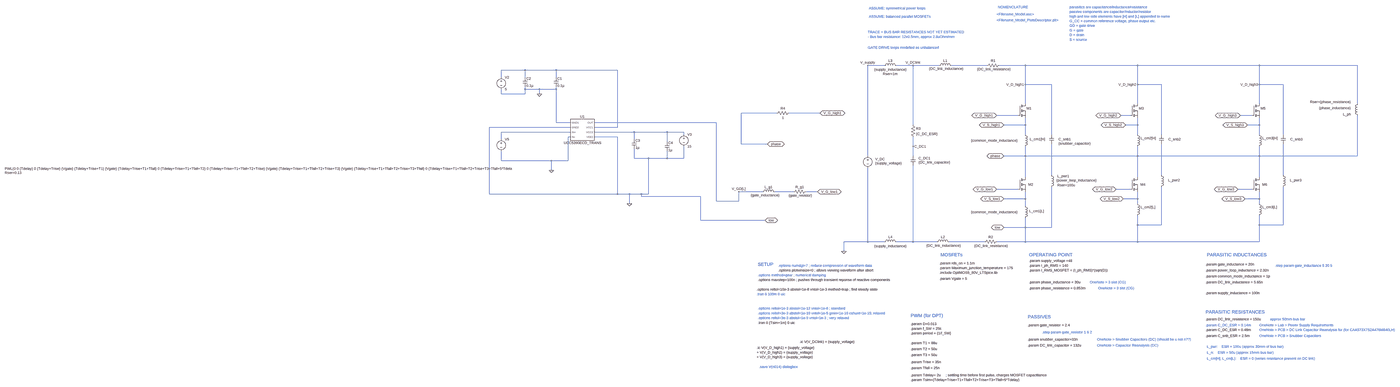
[diagram p0: schematic gate_driver_dpt.asc, whole sheet]
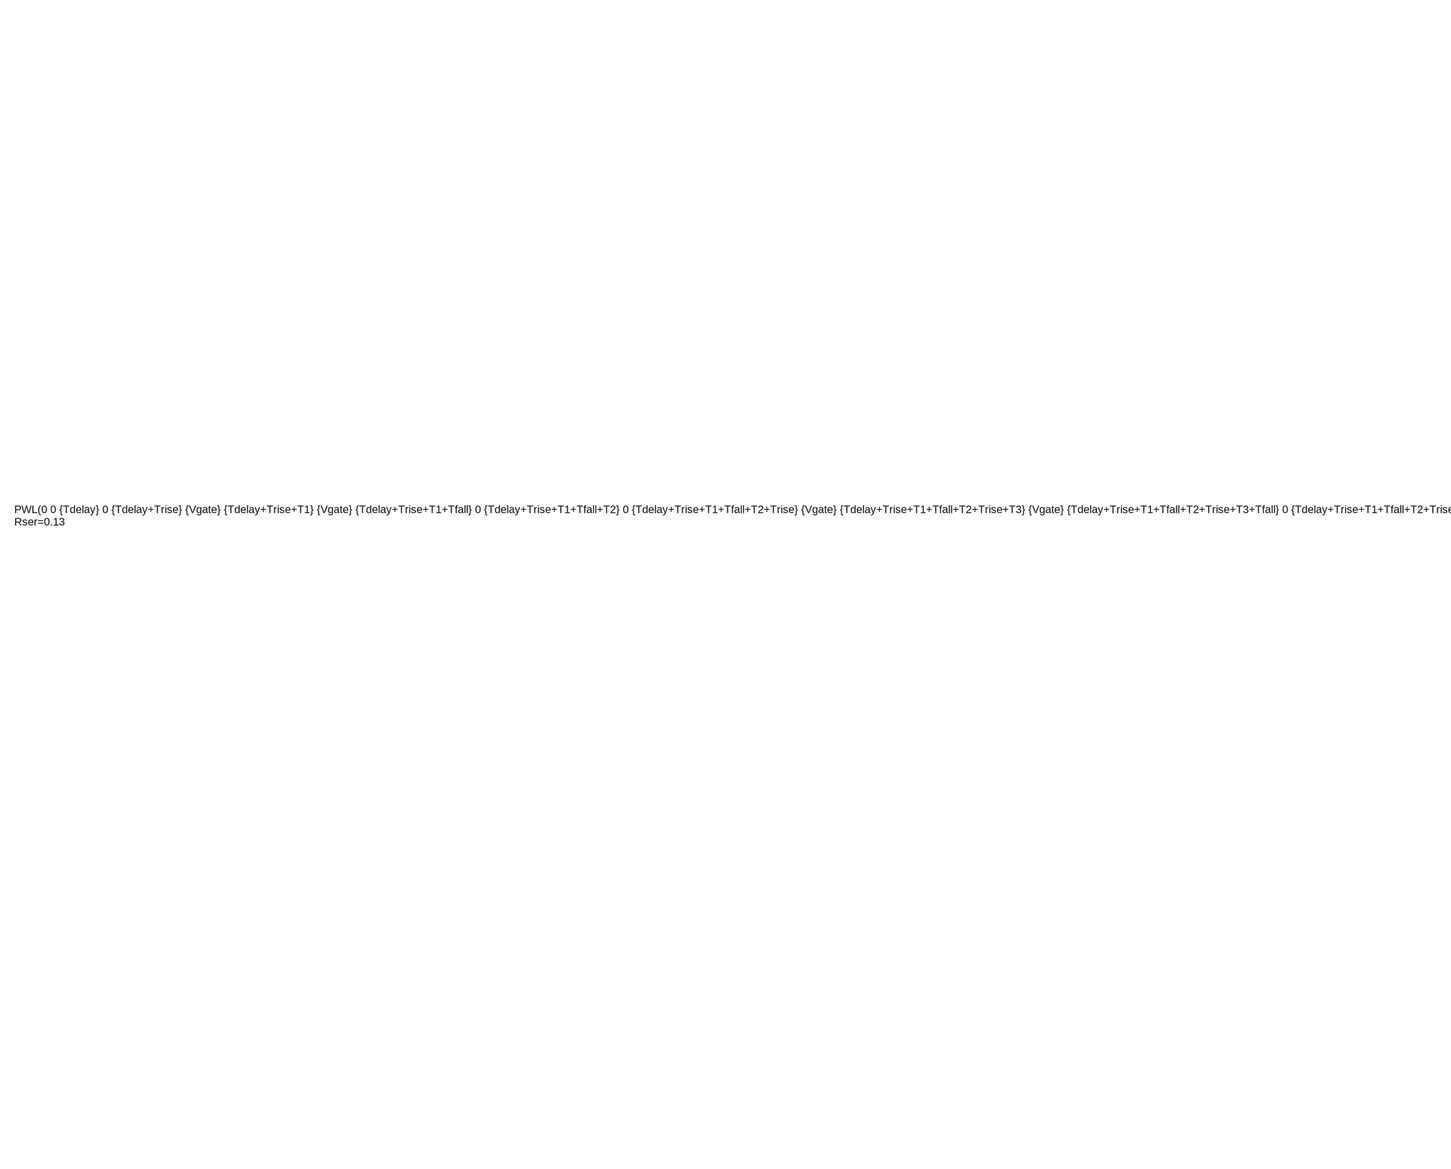
[diagram p1: schematic gate_driver_dpt.asc, part, row 1 of 1, column 1 of 3]
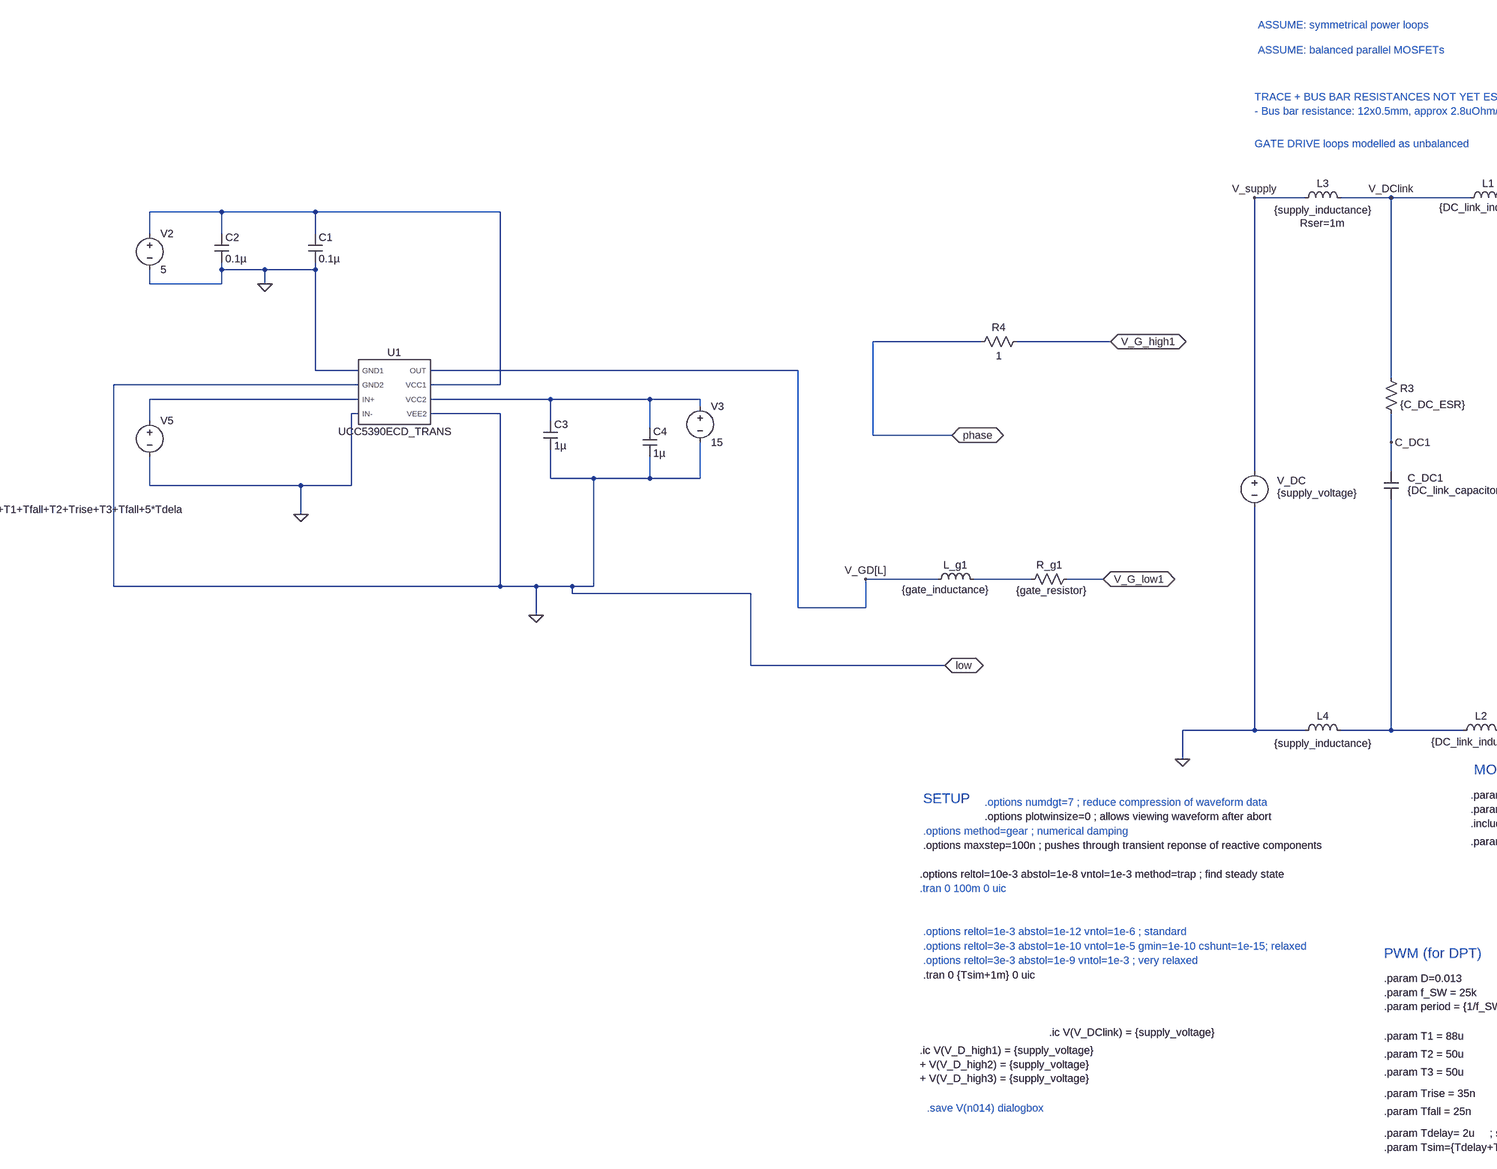
[diagram p2: schematic gate_driver_dpt.asc, part, row 1 of 1, column 2 of 3]
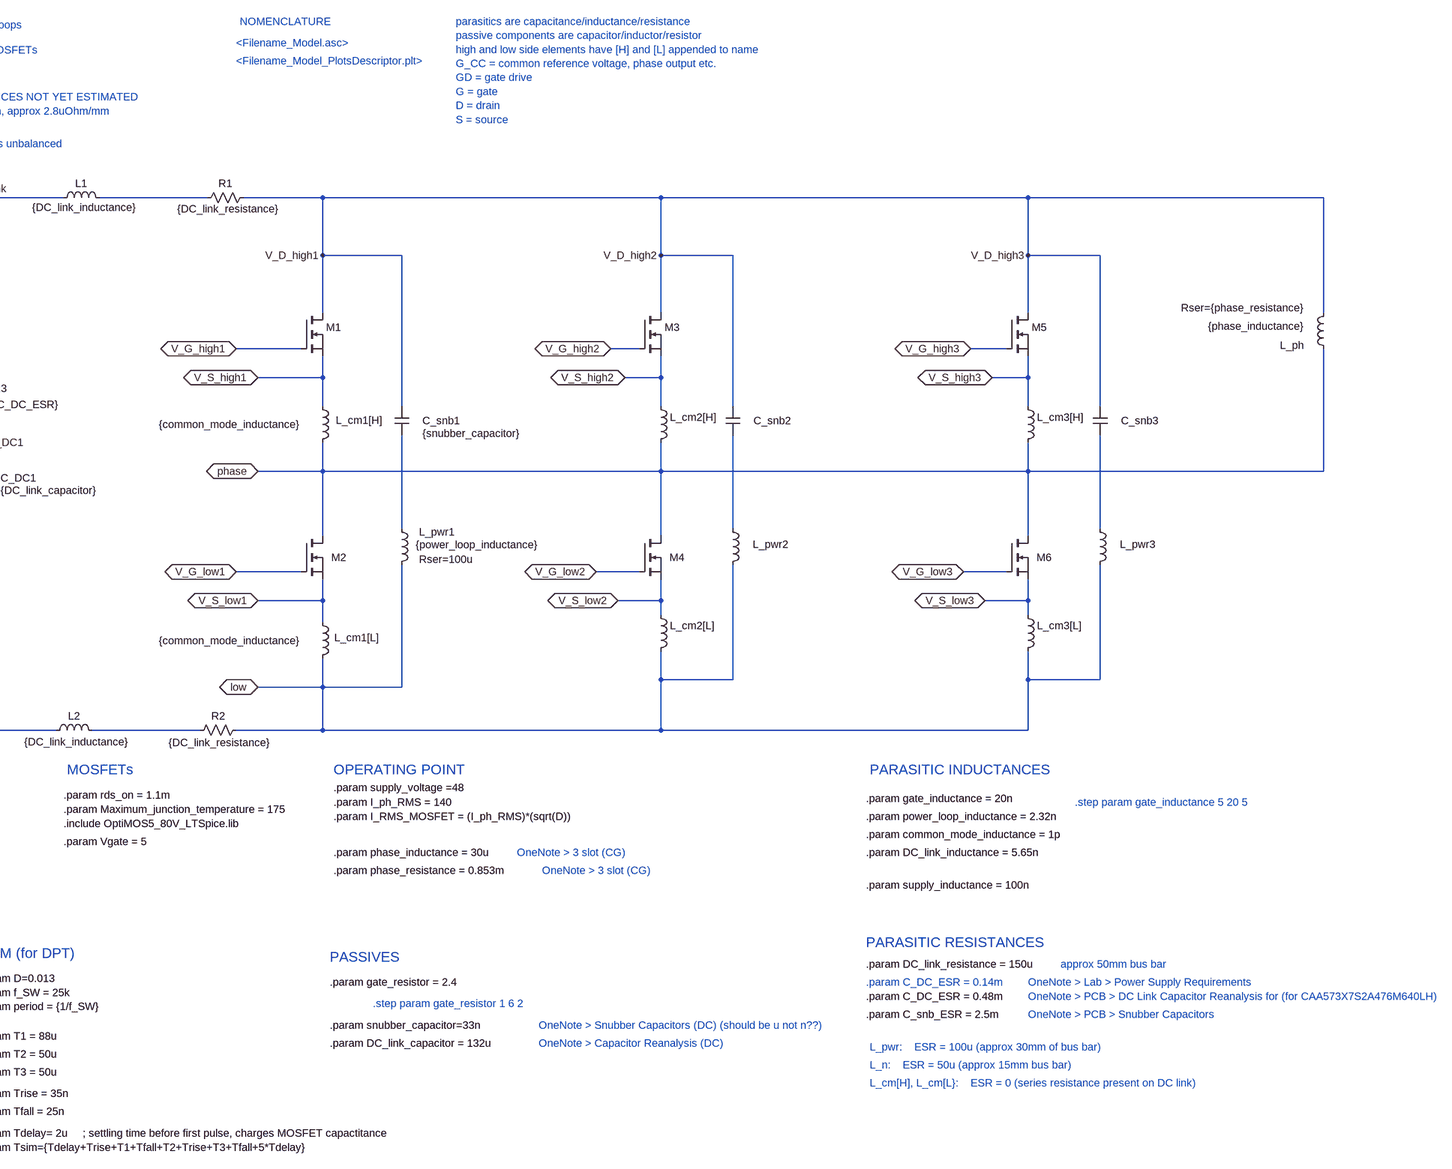
[diagram p3: schematic gate_driver_dpt.asc, part, row 1 of 1, column 3 of 3]
gate_driver_dpt.asc, the LTspice schematic file:
Version 4.1
SHEET 1 7948 3392
WIRE 1136 -928 1024 -928
WIRE 1328 -928 1216 -928
WIRE 1504 -928 1328 -928
WIRE 1824 -928 1584 -928
WIRE 2080 -928 1904 -928
WIRE 2832 -928 2080 -928
WIRE 3648 -928 2832 -928
WIRE 4304 -928 3648 -928
WIRE -2928 -896 -3088 -896
WIRE -2720 -896 -2928 -896
WIRE -2256 -896 -2720 -896
WIRE -3088 -848 -3088 -896
WIRE -2928 -848 -2928 -896
WIRE -2720 -848 -2720 -896
WIRE 2080 -800 2080 -928
WIRE 2256 -800 2080 -800
WIRE 2832 -800 2832 -928
WIRE 2992 -800 2832 -800
WIRE 3648 -800 3648 -928
WIRE 3808 -800 3648 -800
WIRE -2928 -768 -2928 -784
WIRE -2832 -768 -2928 -768
WIRE -2720 -768 -2720 -784
WIRE -2720 -768 -2832 -768
WIRE -3088 -736 -3088 -768
WIRE -2928 -736 -2928 -768
WIRE -2928 -736 -3088 -736
WIRE -2832 -736 -2832 -768
WIRE 2080 -672 2080 -800
WIRE 2832 -672 2832 -800
WIRE 3648 -672 3648 -800
WIRE 4304 -672 4304 -928
WIRE 416 -608 176 -608
WIRE 704 -608 496 -608
WIRE 2032 -592 1888 -592
WIRE 2080 -592 2080 -608
WIRE 2784 -592 2720 -592
WIRE 2832 -592 2832 -608
WIRE 3600 -592 3520 -592
WIRE 3648 -592 3648 -608
WIRE -2720 -544 -2720 -768
WIRE -2624 -544 -2720 -544
WIRE -512 -544 -2464 -544
WIRE 1328 -528 1328 -928
WIRE 2080 -528 2080 -576
WIRE 2080 -528 1936 -528
WIRE 2832 -528 2832 -576
WIRE 2832 -528 2752 -528
WIRE 3648 -528 3648 -576
WIRE 3648 -528 3568 -528
WIRE -2624 -512 -3168 -512
WIRE -2256 -512 -2256 -896
WIRE -2256 -512 -2464 -512
WIRE -2624 -480 -3088 -480
WIRE -2144 -480 -2464 -480
WIRE -1920 -480 -2144 -480
WIRE -1808 -480 -1920 -480
WIRE -1808 -464 -1808 -480
WIRE 2080 -464 2080 -528
WIRE 2256 -464 2256 -800
WIRE 2832 -464 2832 -528
WIRE 2992 -464 2992 -800
WIRE 3648 -464 3648 -528
WIRE 3808 -464 3808 -800
WIRE -2624 -448 -2640 -448
WIRE -2256 -448 -2464 -448
WIRE -3088 -432 -3088 -480
WIRE -2144 -432 -2144 -480
WIRE -1920 -416 -1920 -480
WIRE 176 -400 176 -608
WIRE 352 -400 176 -400
WIRE 1328 -384 1328 -448
WIRE 1024 -320 1024 -928
WIRE 1328 -320 1328 -384
WIRE 2080 -320 2080 -384
WIRE 2080 -320 1936 -320
WIRE 2832 -320 2832 -384
WIRE 2832 -320 2080 -320
WIRE 3648 -320 3648 -384
WIRE 3648 -320 2832 -320
WIRE 4304 -320 4304 -592
WIRE 4304 -320 3648 -320
WIRE -2144 -304 -2144 -368
WIRE -2048 -304 -2144 -304
WIRE -1920 -304 -1920 -352
WIRE -1920 -304 -2048 -304
WIRE -1808 -304 -1808 -384
WIRE -1808 -304 -1920 -304
WIRE -3088 -288 -3088 -352
WIRE -2752 -288 -3088 -288
WIRE -2640 -288 -2640 -448
WIRE -2640 -288 -2752 -288
WIRE -2752 -224 -2752 -288
WIRE 2256 -192 2256 -400
WIRE 2992 -192 2992 -400
WIRE 3808 -192 3808 -400
WIRE 2080 -176 2080 -320
WIRE 2832 -176 2832 -320
WIRE 3648 -176 3648 -320
WIRE 2032 -96 1888 -96
WIRE 2784 -96 2688 -96
WIRE 3600 -96 3504 -96
WIRE 320 -80 160 -80
WIRE 528 -80 400 -80
WIRE 688 -80 608 -80
WIRE -3168 -64 -3168 -512
WIRE -2256 -64 -2256 -448
WIRE -2256 -64 -3168 -64
WIRE -2176 -64 -2256 -64
WIRE -2096 -64 -2176 -64
WIRE -2048 -64 -2048 -304
WIRE -2048 -64 -2096 -64
WIRE -2096 -48 -2096 -64
WIRE -1696 -48 -2096 -48
WIRE 2080 -32 2080 -80
WIRE 2080 -32 1936 -32
WIRE 2832 -32 2832 -80
WIRE 2832 -32 2736 -32
WIRE 3648 -32 3648 -80
WIRE 3648 -32 3552 -32
WIRE -512 -16 -512 -544
WIRE 160 -16 160 -80
WIRE 160 -16 -512 -16
WIRE -2176 0 -2176 -64
WIRE 2832 0 2832 -32
WIRE 3648 0 3648 -32
WIRE 2080 16 2080 -32
WIRE -1696 112 -1696 -48
WIRE 336 112 -1696 112
WIRE 2832 144 2832 80
WIRE 2992 144 2992 -112
WIRE 2992 144 2832 144
WIRE 3648 144 3648 80
WIRE 3808 144 3808 -112
WIRE 3808 144 3648 144
WIRE 2080 160 2080 96
WIRE 2080 160 1936 160
WIRE 2256 160 2256 -112
WIRE 2256 160 2080 160
WIRE 1024 256 1024 -240
WIRE 1024 256 864 256
WIRE 1136 256 1024 256
WIRE 1328 256 1328 -256
WIRE 1328 256 1216 256
WIRE 1488 256 1328 256
WIRE 1808 256 1568 256
WIRE 2080 256 2080 160
WIRE 2080 256 1888 256
WIRE 2832 256 2832 144
WIRE 2832 256 2080 256
WIRE 3648 256 3648 144
WIRE 3648 256 2832 256
WIRE 864 320 864 256
FLAG 704 -608 V_G_high1
IOPIN 704 -608 BiDir
FLAG 688 -80 V_G_low1
IOPIN 688 -80 BiDir
FLAG 1888 -592 V_G_high1
IOPIN 1888 -592 BiDir
FLAG 1888 -96 V_G_low1
IOPIN 1888 -96 BiDir
FLAG 864 320 0
FLAG 1936 -320 phase
IOPIN 1936 -320 BiDir
FLAG 352 -400 phase
IOPIN 352 -400 BiDir
FLAG 2080 -800 V_D_high1
FLAG 160 -80 V_GD[L]
FLAG 1328 -928 V_DClink
FLAG 2720 -592 V_G_high2
IOPIN 2720 -592 BiDir
FLAG 1936 -32 V_S_low1
IOPIN 1936 -32 BiDir
FLAG 336 112 low
IOPIN 336 112 BiDir
FLAG 2688 -96 V_G_low2
IOPIN 2688 -96 BiDir
FLAG 3504 -96 V_G_low3
IOPIN 3504 -96 BiDir
FLAG 3520 -592 V_G_high3
IOPIN 3520 -592 BiDir
FLAG 2752 -528 V_S_high2
IOPIN 2752 -528 BiDir
FLAG 3568 -528 V_S_high3
IOPIN 3568 -528 BiDir
FLAG 2736 -32 V_S_low2
IOPIN 2736 -32 BiDir
FLAG 3552 -32 V_S_low3
IOPIN 3552 -32 BiDir
FLAG 1328 -384 C_DC1
FLAG 1936 -528 V_S_high1
IOPIN 1936 -528 BiDir
FLAG 1024 -928 V_supply
FLAG 2832 -800 V_D_high2
FLAG 3648 -800 V_D_high3
FLAG 1936 160 low
IOPIN 1936 160 BiDir
FLAG -2832 -736 0
FLAG -2752 -224 0
FLAG -2176 0 0
SYMBOL voltage 1024 -336 R0
WINDOW 3 50 65 Left 2
WINDOW 0 50 37 Left 2
WINDOW 123 0 0 Left 0
SYMATTR Value {supply_voltage}
SYMATTR InstName V_DC
SYMATTR SpiceLine Rser=0
SYMBOL cap 1312 -320 R0
WINDOW 0 52 15 Left 2
WINDOW 3 52 43 Left 2
SYMATTR InstName C_DC1
SYMATTR Value {DC_link_capacitor}
SYMATTR SpiceLine Rser=0
SYMBOL cap 2240 -464 R0
WINDOW 0 62 32 Left 2
WINDOW 3 62 60 Left 2
SYMATTR InstName C_snb1
SYMATTR Value {snubber_capacitor}
SYMATTR SpiceLine Rser=0
SYMBOL ind 4320 -576 R180
WINDOW 0 58 24 Left 2
WINDOW 3 59 66 Left 2
WINDOW 39 61 107 Left 2
SYMATTR InstName L_ph
SYMATTR Value {phase_inductance}
SYMATTR SpiceLine Rser={phase_resistance}
SYMBOL nmos 2032 -672 R0
WINDOW 3 56 72 Invisible 2
SYMATTR Value IPTG011N08NM5_L0
SYMATTR InstName M1
SYMATTR Prefix X
SYMBOL nmos 2032 -176 R0
WINDOW 0 67 48 Left 2
WINDOW 3 56 72 Invisible 2
SYMATTR InstName M2
SYMATTR Value IPTG011N08NM5_L0
SYMATTR Prefix X
SYMBOL ind 2064 -480 R0
WINDOW 3 -348 56 Left 2
WINDOW 0 45 47 Left 2
SYMATTR Value {common_mode_inductance}
SYMATTR InstName L_cm1[H]
SYMATTR SpiceLine Rser=0
SYMBOL ind 2064 0 R0
WINDOW 3 -348 57 Left 2
WINDOW 0 42 50 Left 2
SYMATTR Value {common_mode_inductance}
SYMATTR InstName L_cm1[L]
SYMATTR SpiceLine Rser=0
SYMBOL ind 2240 -208 R0
WINDOW 0 54 23 Left 2
WINDOW 3 47 52 Left 2
WINDOW 39 54 84 Left 2
SYMATTR InstName L_pwr1
SYMATTR Value {power_loop_inductance}
SYMATTR SpiceLine Rser=100u
SYMBOL cap 2976 -464 R0
WINDOW 0 62 32 Left 2
WINDOW 3 24 56 Invisible 2
SYMATTR InstName C_snb2
SYMATTR Value {snubber_capacitor}
SYMBOL nmos 2784 -672 R0
WINDOW 3 56 72 Invisible 2
SYMATTR Value IPTG011N08NM5_L0
SYMATTR InstName M3
SYMATTR Prefix X
SYMBOL nmos 2784 -176 R0
WINDOW 0 67 48 Left 2
WINDOW 3 56 72 Invisible 2
SYMATTR InstName M4
SYMATTR Value IPTG011N08NM5_L0
SYMATTR Prefix X
SYMBOL ind 2816 -480 R0
WINDOW 3 36 80 Invisible 2
SYMATTR Value {common_mode_inductance}
SYMATTR InstName L_cm2[H]
SYMATTR SpiceLine Rser=0
SYMBOL ind 2816 -16 R0
WINDOW 3 36 80 Invisible 2
SYMATTR Value {common_mode_inductance}
SYMATTR InstName L_cm2[L]
SYMATTR SpiceLine Rser=0
SYMBOL ind 2976 -208 R0
WINDOW 0 60 51 Left 2
WINDOW 3 36 80 Invisible 2
SYMATTR InstName L_pwr2
SYMATTR Value {power_loop_inductance}
SYMATTR SpiceLine Rser=100u
SYMBOL cap 3792 -464 R0
WINDOW 0 62 32 Left 2
WINDOW 3 24 56 Invisible 2
SYMATTR InstName C_snb3
SYMATTR Value {snubber_capacitor}
SYMBOL nmos 3600 -672 R0
WINDOW 3 56 72 Invisible 2
SYMATTR Value IPTG011N08NM5_L0
SYMATTR InstName M5
SYMATTR Prefix X
SYMBOL nmos 3600 -176 R0
WINDOW 0 67 48 Left 2
WINDOW 3 56 72 Invisible 2
SYMATTR InstName M6
SYMATTR Value IPTG011N08NM5_L0
SYMATTR Prefix X
SYMBOL ind 3632 -480 R0
WINDOW 3 36 80 Invisible 2
SYMATTR Value {common_mode_inductance}
SYMATTR InstName L_cm3[H]
SYMATTR SpiceLine Rser=0
SYMBOL ind 3632 -16 R0
WINDOW 3 36 80 Invisible 2
SYMATTR Value {common_mode_inductance}
SYMATTR InstName L_cm3[L]
SYMATTR SpiceLine Rser=0
SYMBOL ind 3792 -208 R0
WINDOW 0 60 51 Left 2
WINDOW 3 36 80 Invisible 2
SYMATTR InstName L_pwr3
SYMATTR Value {power_loop_inductance}
SYMATTR SpiceLine Rser=100u
SYMBOL ind 1488 -912 R270
WINDOW 0 32 56 VTop 2
WINDOW 3 -21 62 VTop 2
SYMATTR InstName L1
SYMATTR Value {DC_link_inductance}
SYMATTR SpiceLine Rser=0
SYMBOL ind 1472 272 R270
WINDOW 0 32 56 VTop 2
WINDOW 3 -26 60 VTop 2
SYMATTR InstName L2
SYMATTR Value {DC_link_inductance}
SYMATTR SpiceLine Rser=0
SYMBOL res 1920 -944 R90
WINDOW 0 0 56 VBottom 2
WINDOW 3 57 51 VBottom 2
SYMATTR InstName R1
SYMATTR Value {DC_link_resistance}
SYMBOL res 1904 240 R90
WINDOW 0 0 56 VBottom 2
WINDOW 3 59 54 VBottom 2
SYMATTR InstName R2
SYMATTR Value {DC_link_resistance}
SYMBOL ind 1120 -912 R270
WINDOW 0 32 56 VTop 2
WINDOW 3 -27 56 VTop 2
WINDOW 39 -56 55 VTop 2
SYMATTR InstName L3
SYMATTR Value {supply_inductance}
SYMATTR SpiceLine Rser=1m
SYMBOL ind 1120 272 R270
WINDOW 0 32 56 VTop 2
WINDOW 3 -29 56 VTop 2
SYMATTR InstName L4
SYMATTR Value {supply_inductance}
SYMATTR SpiceLine Rser=1m
SYMBOL res 1312 -544 R0
SYMATTR InstName R3
SYMATTR Value {C_DC_ESR}
SYMBOL ind 304 -64 R270
WINDOW 0 32 56 VTop 2
WINDOW 3 -23 33 VTop 2
SYMATTR InstName L_g1
SYMATTR Value {gate_inductance}
SYMATTR SpiceLine Rser=0
SYMBOL res 512 -64 R270
WINDOW 0 32 56 VTop 2
WINDOW 3 -25 61 VTop 2
SYMATTR InstName R_g1
SYMATTR Value {gate_resistor}
SYMBOL res 512 -624 R90
WINDOW 0 0 56 VBottom 2
WINDOW 3 32 56 VTop 2
SYMATTR InstName R4
SYMATTR Value 1
SYMBOL UCC5390ECD_TRANS -2544 -496 R0
SYMATTR InstName U1
SYMBOL voltage -3088 -864 R0
WINDOW 123 0 0 Left 0
WINDOW 39 0 0 Left 0
SYMATTR InstName V2
SYMATTR Value 5
SYMBOL voltage -1808 -480 R0
WINDOW 123 0 0 Left 0
WINDOW 39 0 0 Left 0
SYMATTR InstName V3
SYMATTR Value 15
SYMBOL cap -2736 -848 R0
SYMATTR InstName C1
SYMATTR Value 0.1µ
SYMBOL cap -2944 -848 R0
SYMATTR InstName C2
SYMATTR Value 0.1µ
SYMBOL cap -2160 -432 R0
SYMATTR InstName C3
SYMATTR Value 1µ
SYMBOL cap -1936 -416 R0
SYMATTR InstName C4
SYMATTR Value 1µ
SYMBOL voltage -3088 -448 R0
WINDOW 123 0 0 Left 0
WINDOW 39 -3326 241 Left 2
WINDOW 3 -3326 213 Left 2
SYMATTR SpiceLine Rser=0.13
SYMATTR Value PWL(0 0 {Tdelay} 0 {Tdelay+Trise} {Vgate} {Tdelay+Trise+T1} {Vgate} {Tdelay+Trise+T1+Tfall} 0 {Tdelay+Trise+T1+Tfall+T2} 0 {Tdelay+Trise+T1+Tfall+T2+Trise} {Vgate} {Tdelay+Trise+T1+Tfall+T2+Trise+T3} {Vgate} {Tdelay+Trise+T1+Tfall+T2+Trise+T3+Tfall} 0 {Tdelay+Trise+T1+Tfall+T2+Trise+T3+Tfall+5*Tdelay} 0)
SYMATTR InstName V5
TEXT 1312 808 Left 2 !.param D=0.013\n.param f_SW = 25k\n.param period = {1/f_SW}
TEXT 288 704 Left 2 ;.options reltol=1e-3 abstol=1e-12 vntol=1e-6 ; standard
TEXT 1504 464 Left 2 !.include OptiMOS5_80V_LTSpice.lib
TEXT 2096 912 Left 2 !.param snubber_capacitor=33n
TEXT 2096 952 Left 2 !.param DC_link_capacitor = 132u
TEXT 2104 384 Left 2 !.param supply_voltage =48
TEXT 2104 568 Left 2 !.param phase_resistance = 0.853m
TEXT 2104 528 Left 2 !.param phase_inductance = 30u
TEXT 2104 416 Left 2 !.param I_ph_RMS = 140
TEXT 2104 448 Left 2 !.param I_RMS_MOSFET = (I_ph_RMS)*(sqrt(D))
TEXT 1504 432 Left 2 !.param Maximum_junction_temperature = 175
TEXT 1504 400 Left 2 !.param rds_on = 1.1m
TEXT 3288 488 Left 2 !.param common_mode_inductance = 1p
TEXT 3288 448 Left 2 !.param power_loop_inductance = 2.32n
TEXT 2096 816 Left 2 !.param gate_resistor = 2.4
TEXT 3288 408 Left 2 !.param gate_inductance = 20n
TEXT 288 408 Left 3 ;SETUP
TEXT 1512 344 Left 3 ;MOSFETs
TEXT 2104 344 Left 3 ;OPERATING POINT
TEXT 3296 344 Left 3 ;PARASITIC INDUCTANCES
TEXT 2096 760 Left 3 ;PASSIVES
TEXT 1504 504 Left 2 !.param Vgate = 5
TEXT 2192 864 Left 2 ;.step param gate_resistor 1 6 2
TEXT 3288 528 Left 2 !.param DC_link_inductance = 5.65n
TEXT 1032 -1312 Left 2 ;ASSUME: symmetrical power loops
TEXT 1024 -1152 Left 2 ;TRACE + BUS BAR RESISTANCES NOT YET ESTIMATED\n- Bus bar resistance: 12x0.5mm, approx 2.8uOhm/mm
TEXT 1032 -1256 Left 2 ;ASSUME: balanced parallel MOSFETs
TEXT 280 608 Left 2 ;.tran 0 100m 0 uic
TEXT 1024 -1048 Left 2 ;GATE DRIVE loops modelled as unbalanced
TEXT 3288 600 Left 2 !.param supply_inductance = 100n
TEXT 3288 728 Left 3 ;PARASITIC RESISTANCES
TEXT 3288 776 Left 2 !.param DC_link_resistance = 150u
TEXT 3288 816 Left 2 ;.param C_DC_ESR = 0.14m
TEXT 2560 952 Left 2 ;OneNote > Capacitor Reanalysis (DC)
TEXT 2560 912 Left 2 ;OneNote > Snubber Capacitors (DC) (should be u not n??)
TEXT 2512 528 Left 2 ;OneNote > 3 slot (CG)
TEXT 2568 568 Left 2 ;OneNote > 3 slot (CG)
TEXT 424 448 Left 2 !.options plotwinsize=0 ; allows viewing waveform after abort
TEXT 2376 -1320 Left 2 ;parasitics are capacitance/inductance/resistance\npassive components are capacitor/inductor/resistor\nhigh and low side elements have [H] and [L] appended to name\nG_CC = common reference voltage, phase output etc.\nGD = gate drive\nG = gate\nD = drain\nS = source
TEXT 288 512 Left 2 !.options maxstep=100n ; pushes through transient reponse of reactive components
TEXT 288 768 Left 2 ;.options reltol=3e-3 abstol=1e-9 vntol=1e-3 ; very relaxed
TEXT 280 576 Left 2 !.options reltol=10e-3 abstol=1e-8 vntol=1e-3 method=trap ; find steady state
TEXT 1312 752 Left 3 ;PWM (for DPT)
TEXT 3296 960 Left 2 ;L_pwr:    ESR = 100u (approx 30mm of bus bar)
TEXT 3296 1040 Left 2 ;L_cm[H], L_cm[L}:    ESR = 0 (series resistance present on DC link)
TEXT 3296 1000 Left 2 ;L_n:    ESR = 50u (approx 15mm bus bar)
TEXT 3648 816 Left 2 ;OneNote > Lab > Power Supply Requirements
TEXT 3288 888 Left 2 !.param C_snb_ESR = 2.5m
TEXT 3288 848 Left 2 !.param C_DC_ESR = 0.48m
TEXT 3648 848 Left 2 ;OneNote > PCB > DC Link Capacitor Reanalysis for (for CAA573X7S2A476M640LH)
TEXT 3720 776 Left 2 ;approx 50mm bus bar
TEXT 3648 888 Left 2 ;OneNote > PCB > Snubber Capacitors
TEXT 1312 936 Left 2 !.param T1 = 88u
TEXT 1312 976 Left 2 !.param T2 = 50u
TEXT 1312 1016 Left 2 !.param T3 = 50u
TEXT 1312 1064 Left 2 !.param Trise = 35n
TEXT 1312 1104 Left 2 !.param Tfall = 25n
TEXT 1312 1184 Left 2 !.param Tsim={Tdelay+Trise+T1+Tfall+T2+Trise+T3+Tfall+5*Tdelay}
TEXT 288 800 Left 2 !.tran 0 {Tsim+1m} 0 uic
TEXT 1312 1152 Left 2 !.param Tdelay= 2u     ; settling time before first pulse, charges MOSFET capactitance
TEXT 3752 416 Left 2 ;.step param gate_inductance 5 20 5
TEXT 288 480 Left 2 ;.options method=gear ; numerical damping
TEXT 288 736 Left 2 ;.options reltol=3e-3 abstol=1e-10 vntol=1e-5 gmin=1e-10 cshunt=1e-15; relaxed
TEXT 424 416 Left 2 ;.options numdgt=7 ; reduce compression of waveform data
TEXT 280 968 Left 2 !.ic V(V_D_high1) = {supply_voltage}\n+ V(V_D_high2) = {supply_voltage}\n+ V(V_D_high3) = {supply_voltage}
TEXT 296 1096 Left 2 ;.save V(n014) dialogbox
TEXT 568 928 Left 2 !.ic V(V_DClink) = {supply_voltage}
TEXT 1896 -1320 Left 2 ;NOMENCLATURE
TEXT 1888 -1272 Left 2 ;<Filename_Model.asc>
TEXT 1888 -1232 Left 2 ;<Filename_Model_PlotsDescriptor.plt>

The netlist it stands for:
* gate_driver_dpt.asc
V_DC V_supply 0 {supply_voltage} Rser=0
C_DC1 C_DC1 N012 {DC_link_capacitor} Rser=0
C_snb1 V_D_high3 N008 {snubber_capacitor} Rser=0
L_ph phase V_D_high3 {phase_inductance} Rser={phase_resistance}
X§M1 V_D_high3 V_G_high1 V_S_high1 IPTG011N08NM5_L0  ; pins D G S
X§M2 phase V_G_low1 V_S_low1 IPTG011N08NM5_L0  ; pins D G S
L_cm1[H] V_S_high1 phase {common_mode_inductance} Rser=0
L_cm1[L] V_S_low1 0 {common_mode_inductance} Rser=0
L_pwr1 N008 0 {power_loop_inductance} Rser=100u
C_snb2 V_D_high3 N009 {snubber_capacitor}
X§M3 V_D_high3 V_G_high2 V_S_high2 IPTG011N08NM5_L0  ; pins D G S
X§M4 phase V_G_low2 V_S_low2 IPTG011N08NM5_L0  ; pins D G S
L_cm2[H] V_S_high2 phase {common_mode_inductance} Rser=0
L_cm2[L] V_S_low2 0 {common_mode_inductance} Rser=0
L_pwr2 N009 0 {power_loop_inductance} Rser=100u
C_snb3 V_D_high3 N010 {snubber_capacitor}
X§M5 V_D_high3 V_G_high3 V_S_high3 IPTG011N08NM5_L0  ; pins D G S
X§M6 phase V_G_low3 V_S_low3 IPTG011N08NM5_L0  ; pins D G S
L_cm3[H] V_S_high3 phase {common_mode_inductance} Rser=0
L_cm3[L] V_S_low3 0 {common_mode_inductance} Rser=0
L_pwr3 N010 0 {power_loop_inductance} Rser=100u
L1 V_DClink N001 {DC_link_inductance} Rser=0
L2 N012 N013 {DC_link_inductance} Rser=0
R1 V_D_high3 N001 {DC_link_resistance}
R2 0 N013 {DC_link_resistance}
L3 V_supply V_DClink {supply_inductance} Rser=1m
L4 0 N012 {supply_inductance} Rser=1m
R3 V_DClink C_DC1 {C_DC_ESR}
L_g1 V_GD[L] N011 {gate_inductance} Rser=0
R_g1 N011 V_G_low1 {gate_resistor}
R4 V_G_high1 phase 1
X§U1 0 0 N006 0 V_GD[L] N002 N007 0 UCC5390ECD_TRANS  ; pins GND1 GND2 IN+ IN- OUT VCC1 VCC2 VEE2
V2 N002 0 5
V3 N007 0 15
C1 N002 0 0.1µ
C2 N002 0 0.1µ
C3 N007 0 1µ
C4 N007 0 1µ
V5 N006 0 PWL(0 0 {Tdelay} 0 {Tdelay+Trise} {Vgate} {Tdelay+Trise+T1} {Vgate} {Tdelay+Trise+T1+Tfall} 0 {Tdelay+Trise+T1+Tfall+T2} 0 {Tdelay+Trise+T1+Tfall+T2+Trise} {Vgate} {Tdelay+Trise+T1+Tfall+T2+Trise+T3} {Vgate} {Tdelay+Trise+T1+Tfall+T2+Trise+T3+Tfall} 0 {Tdelay+Trise+T1+Tfall+T2+Trise+T3+Tfall+5*Tdelay} 0) Rser=0.13
.param D=0.013
.param f_SW = 25k
.param period = {1/f_SW}
* .options reltol=1e-3 abstol=1e-12 vntol=1e-6 ; standard
.include OptiMOS5_80V_LTSpice.lib
.param snubber_capacitor=33n
.param DC_link_capacitor = 132u
.param supply_voltage =48
.param phase_resistance = 0.853m
.param phase_inductance = 30u
.param I_ph_RMS = 140
.param I_RMS_MOSFET = (I_ph_RMS)*(sqrt(D))
.param Maximum_junction_temperature = 175
.param rds_on = 1.1m
.param common_mode_inductance = 1p
.param power_loop_inductance = 2.32n
.param gate_resistor = 2.4
.param gate_inductance = 20n
* SETUP
* MOSFETs
* OPERATING POINT
* PARASITIC INDUCTANCES
* PASSIVES
.param Vgate = 5
* .step param gate_resistor 1 6 2
.param DC_link_inductance = 5.65n
* ASSUME: symmetrical power loops
* TRACE + BUS BAR RESISTANCES NOT YET ESTIMATED
* - Bus bar resistance: 12x0.5mm, approx 2.8uOhm/mm
* ASSUME: balanced parallel MOSFETs
* .tran 0 100m 0 uic
* GATE DRIVE loops modelled as unbalanced
.param supply_inductance = 100n
* PARASITIC RESISTANCES
.param DC_link_resistance = 150u
* .param C_DC_ESR = 0.14m
* OneNote > Capacitor Reanalysis (DC)
* OneNote > Snubber Capacitors (DC) (should be u not n??)
* OneNote > 3 slot (CG)
* OneNote > 3 slot (CG)
.options plotwinsize=0 ; allows viewing waveform after abort
* parasitics are capacitance/inductance/resistance
* passive components are capacitor/inductor/resistor
* high and low side elements have [H] and [L] appended to name
* G_CC = common reference voltage, phase output etc.
* GD = gate drive
* G = gate
* D = drain
* S = source
.options maxstep=100n ; pushes through transient reponse of reactive components
* .options reltol=3e-3 abstol=1e-9 vntol=1e-3 ; very relaxed
.options reltol=10e-3 abstol=1e-8 vntol=1e-3 method=trap ; find steady state
* PWM (for DPT)
* L_pwr:    ESR = 100u (approx 30mm of bus bar)
* L_cm[H], L_cm[L}:    ESR = 0 (series resistance present on DC link)
* L_n:    ESR = 50u (approx 15mm bus bar)
* OneNote > Lab > Power Supply Requirements
.param C_snb_ESR = 2.5m
.param C_DC_ESR = 0.48m
* OneNote > PCB > DC Link Capacitor Reanalysis for (for CAA573X7S2A476M640LH)
* approx 50mm bus bar
* OneNote > PCB > Snubber Capacitors
.param T1 = 88u
.param T2 = 50u
.param T3 = 50u
.param Trise = 35n
.param Tfall = 25n
.param Tsim={Tdelay+Trise+T1+Tfall+T2+Trise+T3+Tfall+5*Tdelay}
.tran 0 {Tsim+1m} 0 uic
.param Tdelay= 2u     ; settling time before first pulse, charges MOSFET capactitance
* .step param gate_inductance 5 20 5
* .options method=gear ; numerical damping
* .options reltol=3e-3 abstol=1e-10 vntol=1e-5 gmin=1e-10 cshunt=1e-15; relaxed
* .options numdgt=7 ; reduce compression of waveform data
.ic V(V_D_high1) = {supply_voltage}
+ V(V_D_high2) = {supply_voltage}
+ V(V_D_high3) = {supply_voltage}
* .save V(n014) dialogbox
.ic V(V_DClink) = {supply_voltage}
* NOMENCLATURE
* <Filename_Model.asc>
* <Filename_Model_PlotsDescriptor.plt>
.lib UCC5390ECD_TRANS.LIB
.backanno
.end